# Altium project Mach trai tim.PrjPcb
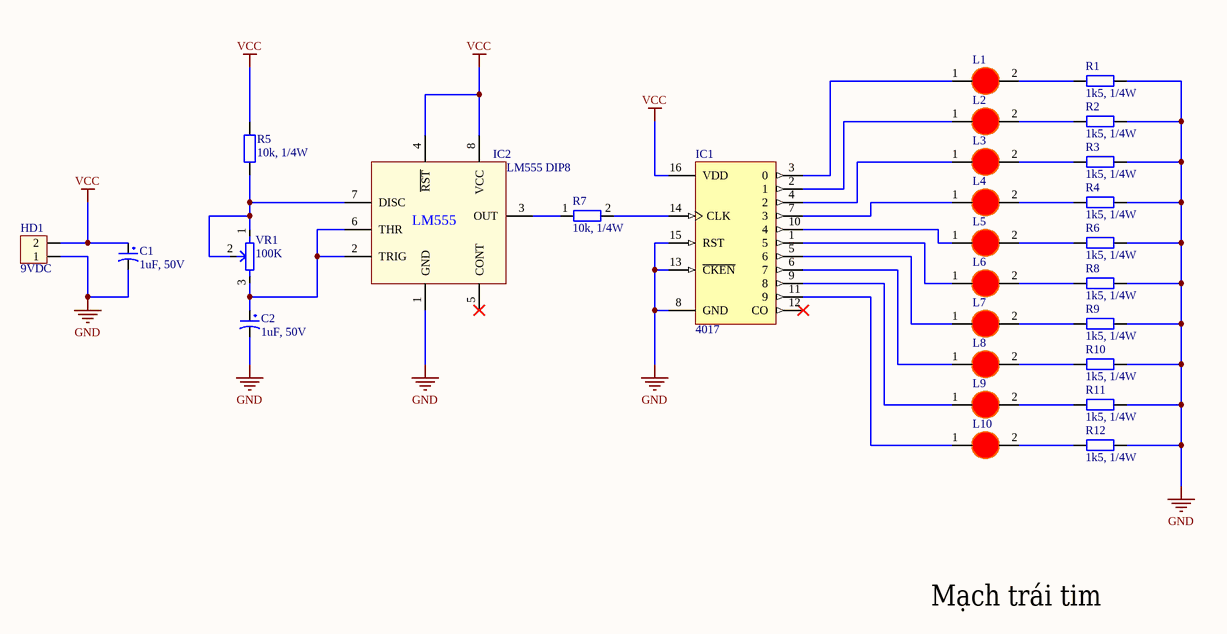
[diagram p0: Mach trai tim.SchDoc]
1 sheet, 28 parts. Net scope: global (net labels, ports and power ports of the same name join across sheets).
Board file: Mach trai tim.PcbDoc

## Sheet Mach trai tim.SchDoc: Mach trai tim
size A4; Date: 18/11/2024; SheetNumber: 1; SheetTotal: 1

### Parts
C1  1uF, 50V  [tu hoa 5mm]
C2  1uF, 50V  [tu hoa 5mm]
HD1  9VDC  [HED2]
IC1  4017  [DIP16/W0.3]
IC2  LM555 DIP8  [LM555]
L1  LED 5mm  [LED-5MM-RED]  (value not drawn)
L2  LED 5mm  [LED-5MM-RED]  (value not drawn)
L3  LED 5mm  [LED-5MM-RED]  (value not drawn)
L4  LED 5mm  [LED-5MM-RED]  (value not drawn)
L5  LED 5mm  [LED-5MM-RED]  (value not drawn)
L6  LED 5mm  [LED-5MM-RED]  (value not drawn)
L7  LED 5mm  [LED-5MM-RED]  (value not drawn)
L8  LED 5mm  [LED-5MM-RED]  (value not drawn)
L9  LED 5mm  [LED-5MM-RED]  (value not drawn)
L10  LED 5mm  [LED-5MM-RED]  (value not drawn)
R1  1k5, 1/4W  [tro vach 1/4w]
R2  1k5, 1/4W  [tro vach 1/4w]
R3  1k5, 1/4W  [tro vach 1/4w]
R4  1k5, 1/4W  [tro vach 1/4w]
R5  10k, 1/4W  [R1/4W]
R6  1k5, 1/4W  [tro vach 1/4w]
R7  10k, 1/4W  [R1/4W]
R8  1k5, 1/4W  [tro vach 1/4w]
R9  1k5, 1/4W  [tro vach 1/4w]
R10  1k5, 1/4W  [tro vach 1/4w]
R11  1k5, 1/4W  [tro vach 1/4w]
R12  1k5, 1/4W  [tro vach 1/4w]
VR1  100K  [Bien Tro Tam Giac Dung]

### Nets
GND: C1.2 C2.2 HD1.1 IC1.8(GND) IC1.13(~{CKEN}) IC1.15(RST) IC2.1(GND) R1.2 R2.2 R3.2 R4.2 R6.2 R8.2 R9.2 R10.2 R11.2 R12.2
VCC: C1.1 HD1.2 IC1.16(VDD) IC2.4(~{RST}) IC2.8(VCC) R5.1
NetC2_1: C2.1 IC2.2(TRIG) IC2.6(THR) VR1.3
NetIC1_1: IC1.1(5) L6.1(A)
NetIC1_2: IC1.2(1) L2.1(A)
NetIC1_3: IC1.3(0) L1.1(A)
NetIC1_4: IC1.4(2) L3.1(A)
NetIC1_5: IC1.5(6) L7.1(A)
NetIC1_6: IC1.6(7) L8.1(A)
NetIC1_7: IC1.7(3) L4.1(A)
NetIC1_9: IC1.9(8) L9.1(A)
NetIC1_10: IC1.10(4) L5.1(A)
NetIC1_11: IC1.11(9) L10.1(A)
NetIC1_14: IC1.14(CLK) R7.2
NetIC2_3: IC2.3(OUT) R7.1
NetIC2_7: IC2.7(DISC) R5.2 VR1.1 VR1.2
NetL1_2: L1.2(K) R1.1
NetL2_2: L2.2(K) R2.1
NetL3_2: L3.2(K) R3.1
NetL4_2: L4.2(K) R4.1
NetL5_2: L5.2(K) R6.1
NetL6_2: L6.2(K) R8.1
NetL7_2: L7.2(K) R9.1
NetL8_2: L8.2(K) R10.1
NetL9_2: L9.2(K) R11.1
NetL10_2: L10.2(K) R12.1

Not connected (* = marked no-connect by the designer): IC1 12(CO)*; IC2 5(CONT)*

### Notes on the sheet
- Mạch trái tim

### Library data of the parts
C1 C2 = Tu Hoa 1uF 50V 5x11: Cắm; Don_Vi: Con; So_Chan: 2; Ten_Linh_Kien: Tụ Hóa 1uF 50V 5x11MM; Ma_Hang: MH001355; Chung_Loai: Cắm; Kieu_Chan: *
HD1 = Hed2: Header 2 (Green); Value: Header 2
IC1 = 4017: Decade Counter/Divider with 10 Decoded Outputs; Designed by: VanDungEvn; Value: CD4017
IC2 = LM555: Supplier 1: Mouser; Supplier Part Number 1: 926-LM555CN/NOPB
L1-L10 = LED 5mm Do: Cắm; Don_Vi: Con; Ma_Hang: MH008967; Ten_Linh_Kien: Led 5MM Phủ Đỏ (1000c); Ghi_Chu: *; Kieu_Chan: *; Chung_Loai: Cắm
R1-R4 R6 R8-R12 = Tro Vach 1/4W 5% 1k: Cắm; Don_Vi: Con; So_Chan: 2; Ten_Linh_Kien: Trở Vạch 1/4w 5% 1k; Ma_Hang: MH007390; Chung_Loai: Cắm; Kieu_Chan: *
R5 R7 = R1/4W: Resistor 1/4W; Value: R1/4W - 1K
VR1 = Bien tro tam giac 100K Dung: Cắm; Don_Vi: Con; Ten_Linh_Kien: Biến Trở Tam Giác 104-100K RM065; Ma_Hang: MH003711; Chung_Loai: Cắm; Ghi_Chu: *; Kieu_Chan: *